# EAGLE design Grove - IMU 10DOF v1.1 (EAGLE 6.4)

## Sheet 1 of 2
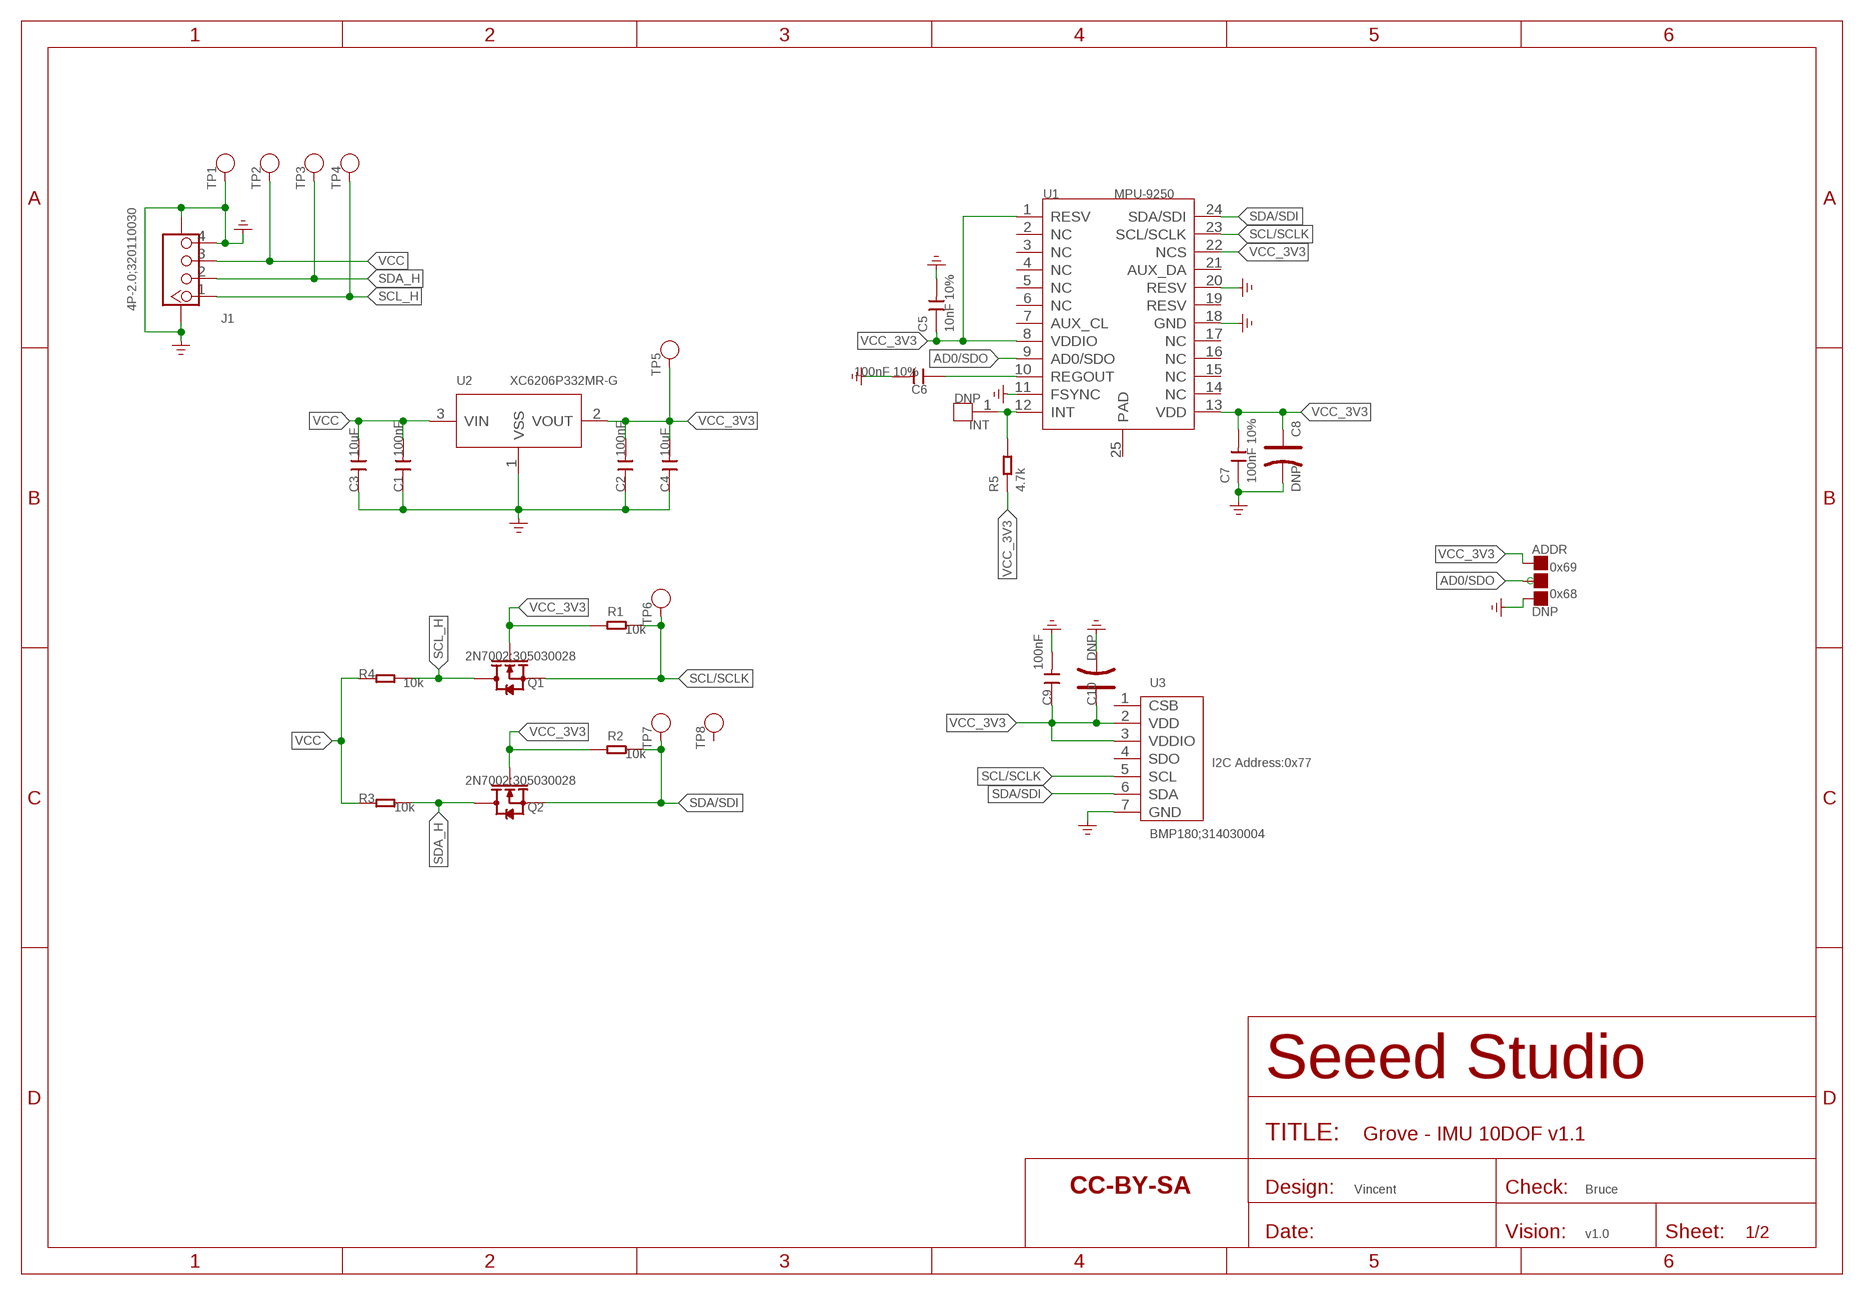
[diagram p0: schematic, sheet 1]

### Parts
ADDR  DNP  PAD-JUMPER-3P-40*40  [3P-SMD-L4.1*W1.5MM]
C1  100nF  CAP-0603  [C0603]
C2  100nF  CAP-0603  [C0603]
C3  10uF  CAP-0805  [C0805]
C4  10uF  CAP-0805  [C0805]
C5  10nF 10%  CAP-0603  [C0603]
C6  100nF 10%  CAP-0603  [C0603]
C7  100nF 10%  CAP-0603  [C0603]
C8  DNP  CAP-POLAR-AVX-A  [AVX-A]
C9  100nF  CAP-0603  [C0603]
C10  DNP  CAP-POLAR-AVX-A  [AVX-A]
INT  DNP  HEADER-1P-35  [1P-65/35MIL]
J1  4P-2.0;320110030  GROVE-CONNECTOR-SMD'DD'  [4P-SMD-2.0]
Q1  2N7002;305030028  MOSFET-N'SOT23'  [SOT-23]
Q2  2N7002;305030028  MOSFET-N'SOT23'  [SOT-23]
R1  10k  RES-0603  [R0603]
R2  10k  RES-0603  [R0603]
R3  10k  RES-0603  [R0603]
R4  10k  RES-0603  [R0603]
R5  4.7k  RES-0603  [R0603]
TP1  DNP  PAD-TEST-POINT'4545'  [TP-D45MIL]
TP2  DNP  PAD-TEST-POINT'4545'  [TP-D45MIL]
TP3  DNP  PAD-TEST-POINT'4545'  [TP-D45MIL]
TP4  DNP  PAD-TEST-POINT'4545'  [TP-D45MIL]
TP5  DNP  PAD-TEST-POINT'4545'  [TP-D45MIL]
TP6  DNP  PAD-TEST-POINT'4545'  [TP-D45MIL]
TP7  DNP  PAD-TEST-POINT'4545'  [TP-D45MIL]
TP8  DNP  PAD-TEST-POINT'4545'  [TP-D45MIL]
U1  MPU-9250  [LEAD-QFN24]
U2  XC6206P332MR-G  PMIC-XC6206PMR  [SOT-23]
U3  BMP180;314030004  BMP180  [LGA-7]
U$1  SEEEDSTUDIO-OPEN-SCH-FRAME  [SEEEDSTUDIO-PCB-FRAME]

### Nets
AD0/SDO: ADDR.MM(C) U1.9(AD0/SDO)
GND: ADDR.11(R) C1.1 C2.1 C3.1 C4.1 C5.2 C6.2 C7.1 C8.- C9.2 C10.- J1.4 J1.SS1 J1.SS2 TP1.T U1.11(FSYNC) U1.18(GND) U1.20(RESV) U2.1(VSS) U3.7(GND) ; supply symbol labelled GND_POWER
N$3: C6.1 U1.10(REGOUT)
N$4: INT.1 R5.2 U1.12(INT)
SCL/SCLK: Q1.2(S) R1.2 TP6.T U1.23(SCL/SCLK) U3.5(SCL)
SCL_H: J1.1 Q1.3(D) R4.2 TP4.T
SDA/SDI: Q2.2(S) R2.2 TP7.T U1.24(SDA/SDI) U3.6(SDA)
SDA_H: J1.2 Q2.3(D) R3.2 TP3.T
VCC: C1.2 C3.2 J1.3 R3.1 R4.1 TP2.T U2.3(VIN)
VCC_3V3: ADDR.00(L) C2.2 C4.2 C5.1 C7.2 C8.+ C9.1 C10.+ Q1.1(G) Q2.1(G) R1.1 R2.1 R5.1 TP5.T U1.1(RESV) U1.8(VDDIO) U1.13(VDD) U1.22(NCS) U2.2(VOUT) U3.2(VDD) U3.3(VDDIO)
Unconnected: TP8.T U1.2(NC) U1.3(NC) U1.4(NC) U1.5(NC) U1.6(NC) U1.7(AUX_CL) U1.14(NC) U1.15(NC) U1.16(NC) U1.17(NC) U1.19(RESV) U1.21(AUX_DA) U1.25(PAD) U3.1(CSB) U3.4(SDO)

### Notes on the sheet
- 0x69
- 0x68
- I2C Address:0x77
- Vincent | Bruce
- v1.0

## Sheet 2 of 2

## Library data of the parts
ADDR = Discrete-new:PAD-JUMPER-3P; PARTNO: DNP
C1-C7 C9 = Discrete-new:CAP: Ceramic Capacitors
C8 C10 = Discrete-new:CAP-POLAR: Electrolytic Capacitors,Tantalum Capacitors and Super Capacitors
INT = Connector-new:HEADER-1P
J1 = Connector-new:GROVE-CONNECTOR-SMD: 4P-SMD-2.0:320110030;4P-SMD-2.0-90D:320110032
Q1 Q2 = Discrete-new:MOSFET-N: IRLL014: http://www.vishay.com/docs/91319/sihll014.pdf
R1-R5 = Discrete-new:RES
TP1-TP8 = Discrete-new:PAD-TEST-POINT; PARTNO: DNP
U1 = template:MPU-9250
U2 = IC-new:PMIC-XC6206P: LOW ESR Cap.Compatible Positive Voltage Regulators
U3 = template:BMP180: Digital pressure sensor
U$1 = moudle-new:SEEEDSTUDIO-OPEN-SCH-FRAME

## Board
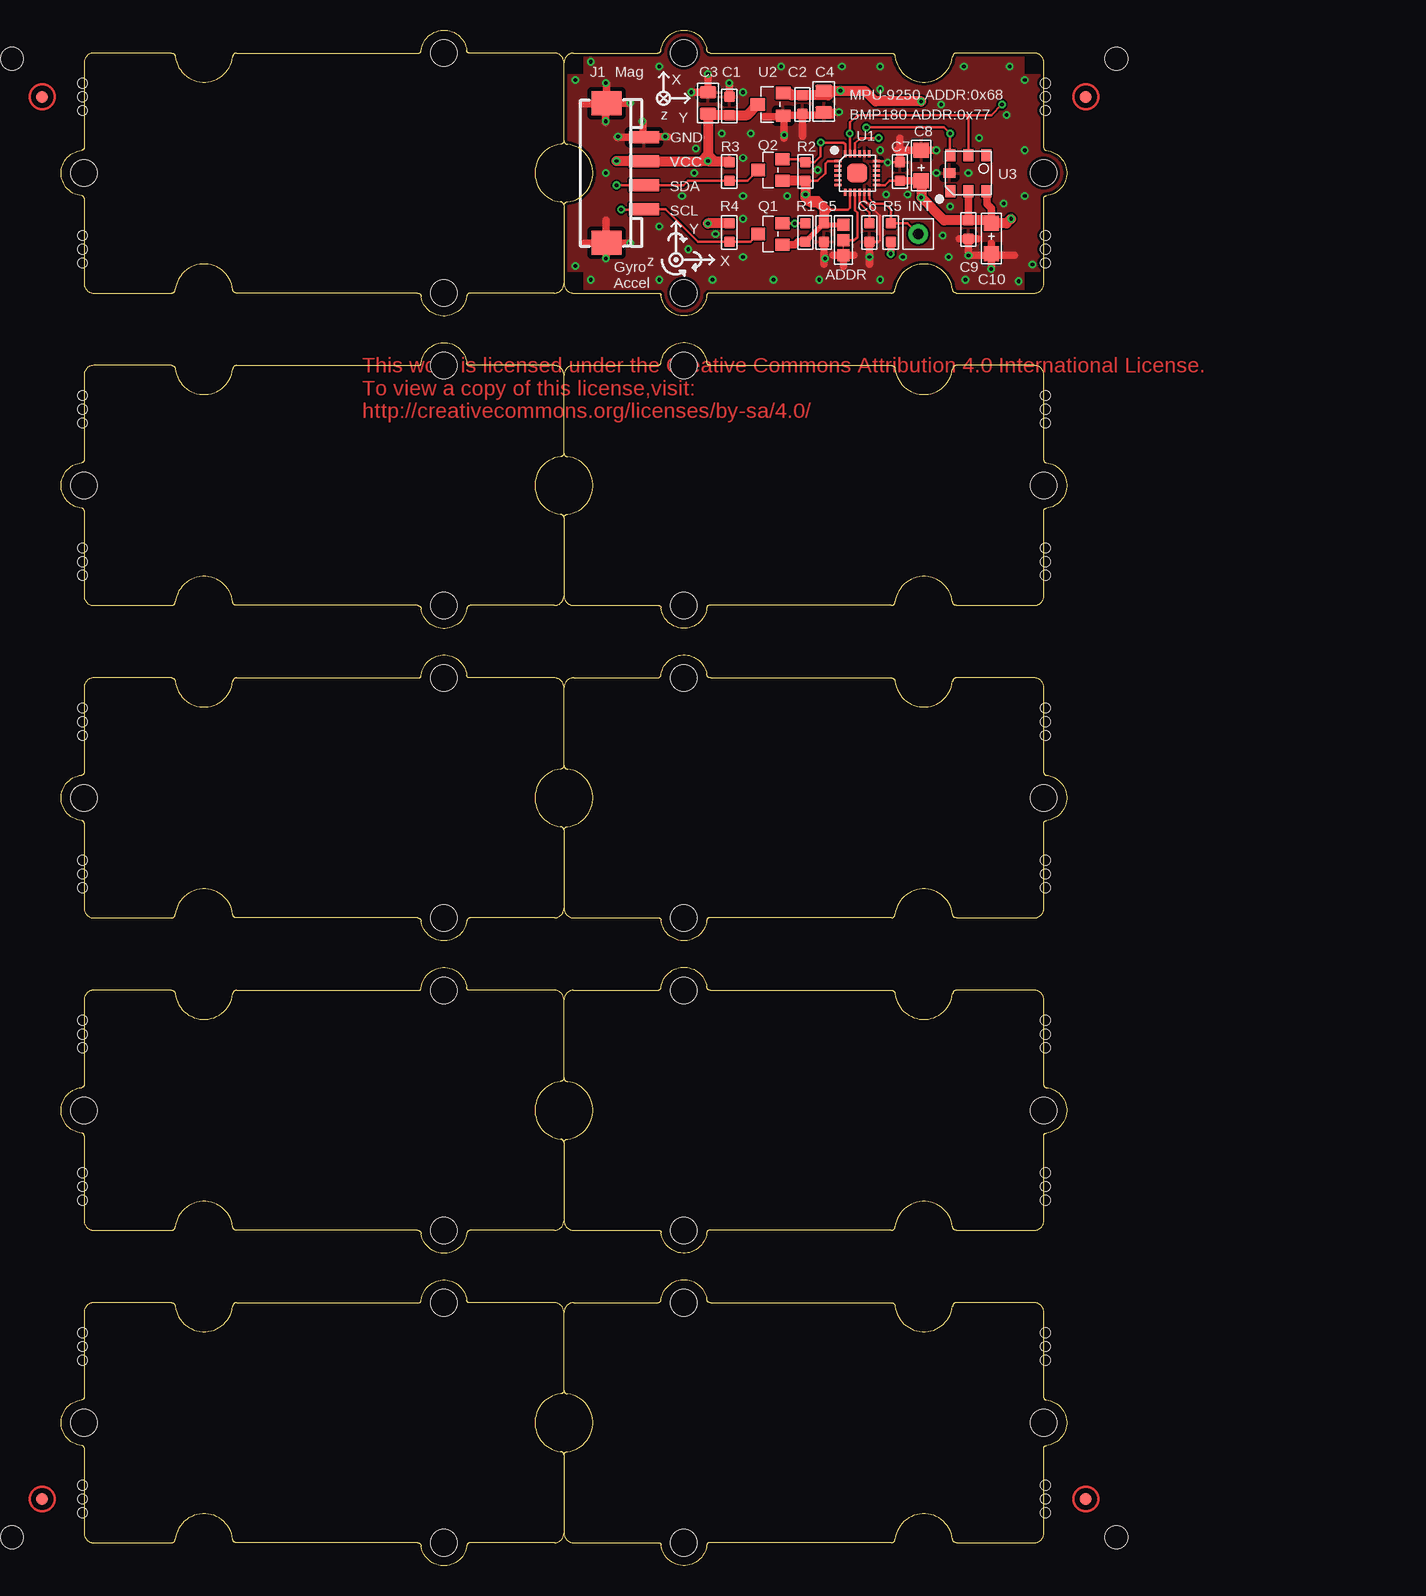
[diagram p1: board, top side]
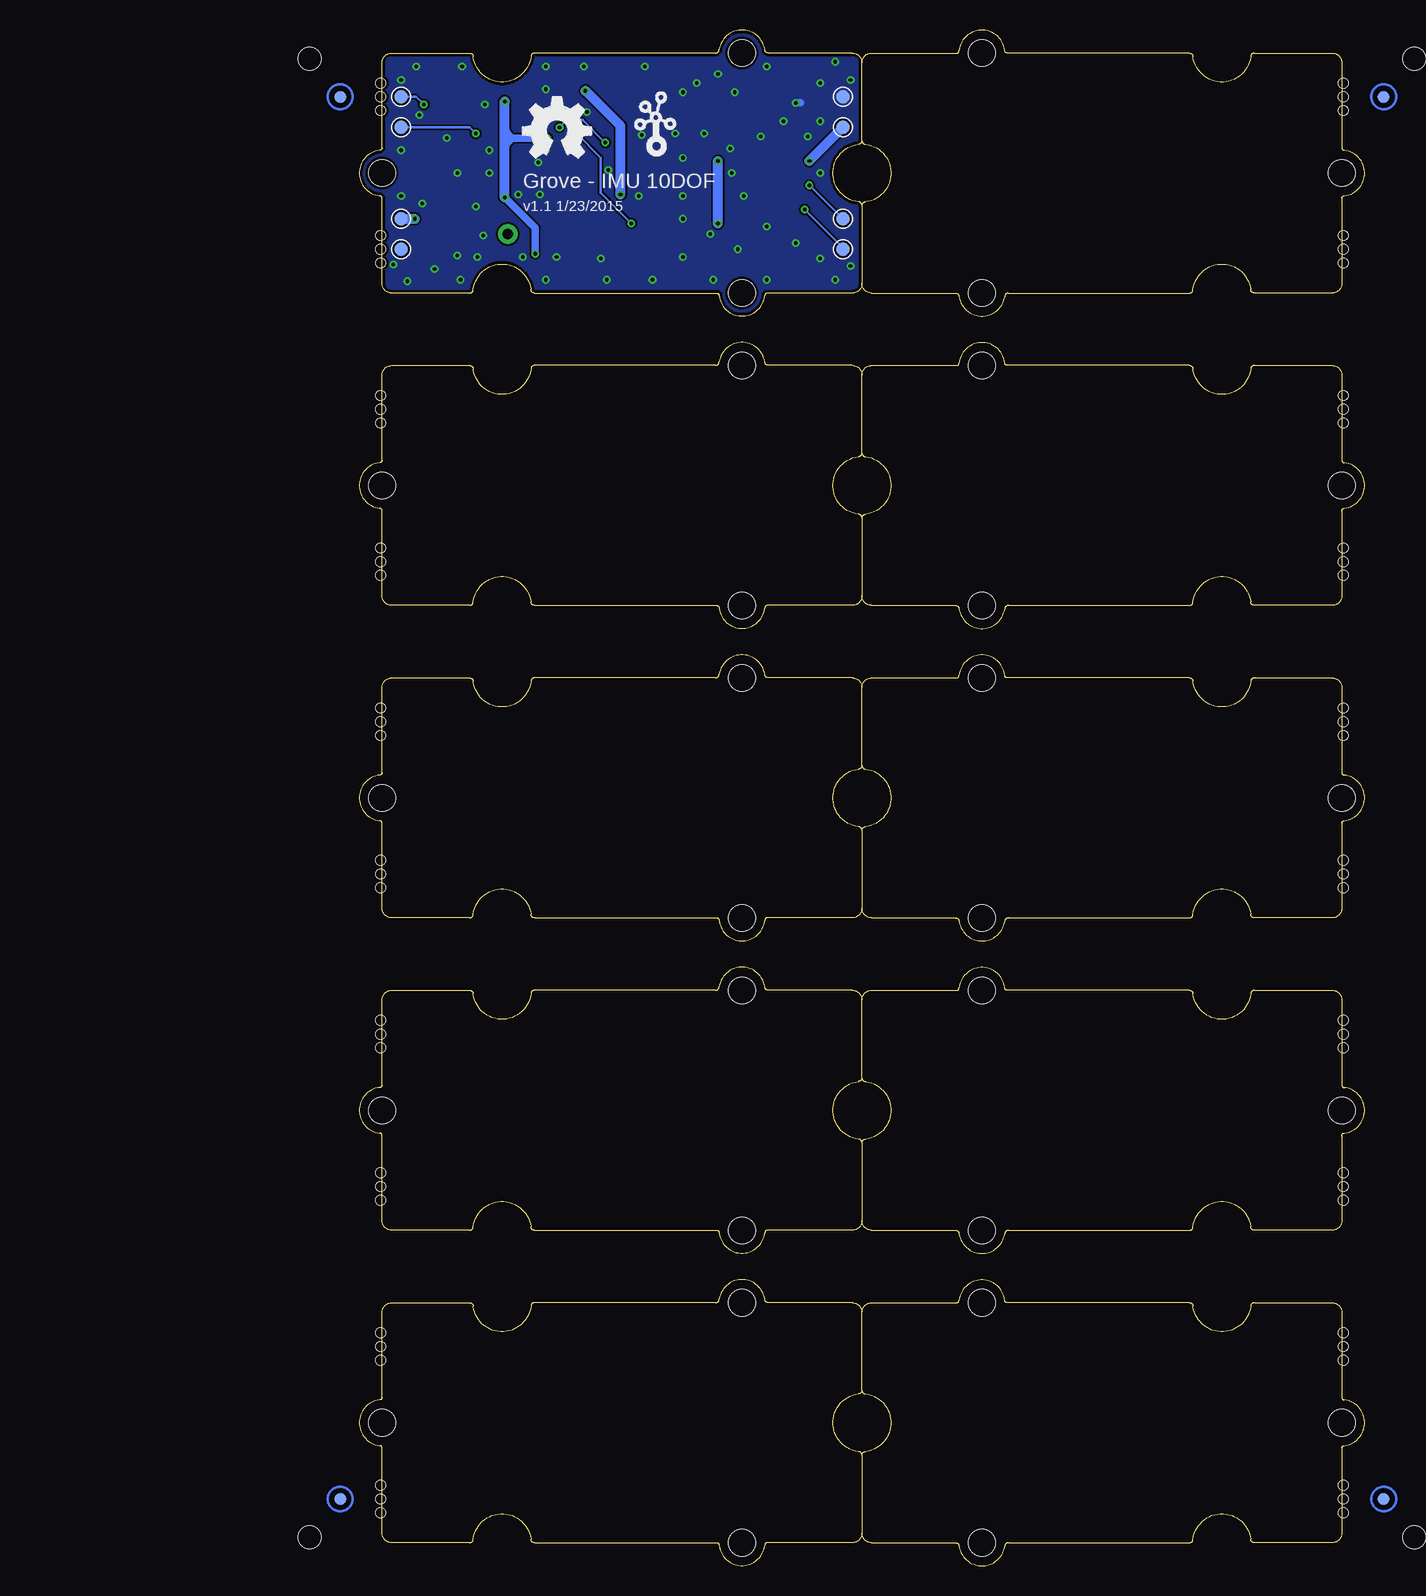
[diagram p2: board, bottom side, seen from below]

Size 83.82 x 127.98 mm. Coordinates in mm from the lower left corner, seen from the top.
Copper layers (1*16): Top 0.035mm / dielectric 1.5mm / Bottom 0.035mm
Design rules "SeeedStudio_2layer_DRU_no_angle_20140221 *": minimum track width 4mil, minimum drill 12mil, track to track 6mil, track to pad 6mil, pad to pad 5mil, via to via 6mil, smd to smd 0mil, copper to edge 10mil, drill to drill 10mil, minimum pad ring 10mil, minimum via ring 6mil, stop-mask expansion 2mil, vias tented up to drill 25mil, thermal gap 14mil
Holes 0.8 mm at 1.78,123.55 1.78,121.27 1.78,122.41 1.78,110.85 1.78,108.57 1.78,109.71 1.78,97.52 1.78,95.23 1.78,96.38 1.78,84.82 1.78,82.53 1.78,83.68 1.78,71.48 1.78,69.2 1.78,70.34 1.78,58.78 1.78,56.5 1.78,57.64 1.78,45.45 1.78,43.16 1.78,44.31 1.78,32.75 1.78,30.46 1.78,31.61 1.78,19.41 1.78,17.13 1.78,18.27 1.78,6.71 1.78,4.43 1.78,5.57 82.04,121.27 82.04,123.55 82.04,122.41 82.04,108.57 82.04,110.85 82.04,109.71 82.04,95.23 82.04,97.52 82.04,96.38 82.04,82.53 82.04,84.82 82.04,83.68 82.04,69.2 82.04,71.48 82.04,70.34 82.04,56.5 82.04,58.78 82.04,57.64 82.04,43.16 82.04,45.45 82.04,44.31 82.04,30.46 82.04,32.75 82.04,31.61 82.04,17.13 82.04,19.41 82.04,18.27 82.04,4.43 82.04,6.71 82.04,5.57
Holes 1.91 mm at -4.13,2.4 87.95,2.4 87.95,125.59 -4.13,125.59

### Footprints (pad centres in the part's own frame; a part is rotated, then mirrored left to right if it is on the bottom)
3P-SMD-L4.1*W1.5MM = smd 1.016 x 1.016: 00 -1.27,0; 11 1.27,0; MM 0,0
C0603 = smd 0.889 x 0.889: 1 0,0.762; 2 0,-0.762
C0805 = smd 1.397 x 1.016: 1 0,0.889; 2 0,-0.889
AVX-A = smd 1.27 x 1.27: + -1.27,0; - 1.27,0
1P-65/35MIL = drill 0.889 pad 1.651: 1 0,0
4P-SMD-2.0 = smd 1 x 2.5: 1 -3,0; 2 -1,0; 3 1,0; 4 3,0 | smd 2 x 2.5: SS1 -5.8,3.123; SS2 5.8,3.123
ROUND-MARK-1.0 = smd 1.016 x 1.016: P$1 0,0
SOT-23 = smd 1.016 x 1.143: 1 -0.889,-1.016; 2 0.889,-1.016; 3 0,1.016
R0603 = smd 0.889 x 0.889: 1 0,0.762; 2 0,-0.762
TP-D45MIL = smd 1.143 x 1.143: T 0,0
LEAD-QFN24 = smd 0.6 x 0.2: 1 -1.6,1; 2 -1.6,0.6; 3 -1.6,0.2; 4 -1.6,-0.2; 5 -1.6,-0.6; 6 -1.6,-1; 13 1.6,-1; 14 1.6,-0.6; 15 1.6,-0.2; 16 1.6,0.2; 17 1.6,0.6; 18 1.6,1 | smd 0.2 x 0.6: 7 -1,-1.6; 8 -0.6,-1.6; 9 -0.2,-1.6; 10 0.2,-1.6; 11 0.6,-1.6; 12 1,-1.6; 19 1,1.6; 20 0.6,1.6; 21 0.2,1.6; 22 -0.2,1.6; 23 -0.6,1.6; 24 -1,1.6 | smd 1.7 x 1.54: 25 0,0
SOT-23' = smd 1.016 x 1.2: 1 -0.95,-1.06; 2 0.95,-1.06; 3 0,1.06
LGA-7 = smd 0.8 x 1: 1 1.5,1.5; 2 0,1.5; 3 -1.5,1.5; 4 -1.5,-1.5; 5 0,-1.5; 6 1.5,-1.5 | smd 1 x 0.8: 7 1.6,0
GROVE-TEST-PLATFORM = hole 2.2: -10,-10; -10,10; 20,0
GROVE-1*2-TEST-PLATFORM = hole 2.2: -10,-10; -10,10; 20,0

### Placement (x,y rotation side)
ADDR  65.22,110.47 270 top
C1  55.69,121.65 0 top
C2  61.79,121.78 180 top
C3  53.91,121.9 0 top
C4  63.56,122.03 180 top
C5  63.56,111.11 0 top
C6  67.37,111.11 0 top
C7  69.91,116.19 0 top
C8  71.69,116.7 90 top
C9  75.63,111.36 0 top
C10  77.53,110.6 270 top
INT  71.44,110.98 0 top
J1  48.58,116.06 90 top
P1  [ROUND-MARK-1.0]  -1.59,5.57 0 top
P2  [ROUND-MARK-1.0]  85.41,5.57 0 top
P3  [ROUND-MARK-1.0]  -1.59,122.41 0 top
P4  [ROUND-MARK-1.0]  85.41,122.41 0 top
P5  [ROUND-MARK-1.0]  -1.59,5.57 0 bottom
P6  [ROUND-MARK-1.0]  85.41,5.57 0 bottom
P7  [ROUND-MARK-1.0]  85.41,122.41 0 bottom
P8  [ROUND-MARK-1.0]  -1.59,122.41 0 bottom
Q1  59.12,110.98 90 top
Q2  59.12,116.32 90 top
R1  62.04,111.11 180 top
R2  62.04,116.19 180 top
R3  55.69,116.19 0 top
R4  55.69,111.11 0 top
R5  69.15,111.11 180 top
TP1  43.5,122.41 0 bottom
TP2  43.5,119.87 0 bottom
TP3  43.5,112.25 0 bottom
TP4  43.5,109.71 0 bottom
TP5  80.33,112.25 0 bottom
TP6  80.33,122.41 0 bottom
TP7  80.33,119.87 0 bottom
TP8  80.33,109.71 0 bottom
U1  66.36,116.06 0 top
U2  XC6206P332MR-G  [SOT-23']  59.12,121.78 90 top
U3  75.63,116.06 180 top
U4  [GROVE-TEST-PLATFORM]  61.91,37.96 0 top
U5  [GROVE-TEST-PLATFORM]  21.91,37.96 180 top
U6  [GROVE-TEST-PLATFORM]  61.91,63.99 0 top
U7  [GROVE-TEST-PLATFORM]  21.91,63.99 180 top
U8  [GROVE-TEST-PLATFORM]  61.91,90.03 0 top
U9  [GROVE-TEST-PLATFORM]  21.91,90.03 180 top
U10  [GROVE-TEST-PLATFORM]  21.91,116.06 180 top
U11  [GROVE-TEST-PLATFORM]  61.91,116.06 0 top
U12  [GROVE-TEST-PLATFORM]  61.91,11.92 0 top
U13  [GROVE-TEST-PLATFORM]  21.91,11.92 180 top
U$1  25.08,95.61 0 top
U$15  [GROVE-1*2-TEST-PLATFORM]  61.91,116.06 0 top
U$16  [GROVE-SILK-SMALL]  61.28,117.33 0 bottom
U$17  [OSHW_FILLX200_NOTEXT]  70.17,117.33 0 bottom

### Tracks (layer width: path | path; a pad name or v marks a point on that pad's centre or on a via)
AD0/SDO
  Top 0.102: 65.22,109.46 65.22,110.35
  Top 0.203: U1.9 66.16,112.96 66.36,112.76 66.36,110.73 66.1,110.47 ADDR.MM 65.22,110.35
GND  (via drill 0.3 pad 0.64)
  Top 0.203: U1.18 68.88,117.06 68.99,116.95 C7.1 | U1.11 66.96,113.81 68.26,112.51 68.26,110.47 68.14,110.35 C6.2 | 48.63,119.07 46.46,119.07 v46.42,119.11
  Top 0.61: J1.SS2 47.39,121.86 v47.44,121.9 | ADDR.11 65.22,108.31 | ADDR.11 66.1,109.2 | 64.33,109.2 ADDR.11 | 45.45,121.57 45.45,123.51 | 45.35,121.82 43.41,121.82 | 45.36,121.85 45.36,120.29 | 48.63,119.07 50.57,119.07 | 48.49,119.03 48.49,120.34 | 48.27,119.02 46.33,119.02 | C5.2 63.56,108.44 | C6.2 67.37,108.44 | C9.2 v75.63,109.2 77.41,109.2 | 77.53,109.2 v77.53,108.06 | 77.53,109.2 79.44,109.2 | 69.91,117.08 69.91,118.98 | v72.96,117.97 69.66,117.97 | v53.91,124.32 C3.1 v52.52,122.79 | C1.1 v55.69,123.55 | v45.4,108.95 45.4,110.09 | v47.44,110.22 45.4,110.22 | 45.4,110.22 43.63,110.22 | 45.4,112.12 45.4,110.22 | 63.44,121.14 v64.83,121.14 | 58.61,120.76 60.52,120.76 | 60.26,118.98 60.26,120.89 | 61.79,119.11 C2.1 | 64.2,120.89 60.39,120.89 | 74.87,110.6 C9.2 | C9.2 76.39,110.6 | 77.53,109.2 77.53,110.22
  Bottom 0.61: v47.44,121.9 47.05,121.9
  other vias: 49.85,124.95 44.13,125.33 60.01,124.95 65.09,124.95 68.26,124.95 75.25,124.95 79.06,124.95 78.8,120.89 49.85,107.17 44.13,107.17 42.86,108.31 49.85,111.62 54.29,107.17 59.37,107.17 63.18,107.17 68.26,107.17 56.83,117.33 56.83,112.25 51.75,114.16 57.47,119.36 80.33,117.97 80.33,114.16 75.63,116.06 72.96,116.06 60.26,119.24 68.26,123.05 73.34,121.78 68.77,114.28 74.11,113.27 73.47,110.85 75.38,107.17 79.82,107.04 67.37,109.08 63.69,108.95 48.45,120.38 45.4,123.55 45.4,120.38 56.83,122.79 55.06,119.36 56.83,114.16 56.83,109.08 80.96,108.44 80.33,123.81 42.86,123.81 68.9,116.95 68.26,117.97 76.52,118.98 78.55,113.52 60.52,114.16 50.36,119.11 63.06,116.32 70.55,114.28 70.17,109.08 73.98,109.08 54.55,110.98 52.26,109.71 45.4,116.06 52.77,116.06 52.9,118.09
  pour Top: 38.42,129.27 86.68,129.27 86.68,100.19 38.42,100.19
  pour Bottom (rank 2): 38.42,129.27 86.68,129.27 86.68,100.19 38.42,100.19
  pour Bottom (rank 2): 38.67,129.27 86.93,129.27 86.93,100.19 38.67,100.19
N$3
  Top 0.203: U1.10 66.56,113.58 67.37,112.76 C6.1
N$4
  Top 0.203: U1.12 67.36,113.92 67.76,113.52 68.64,113.52 69.15,113.01 R5.2 70.55,111.87 INT.1
SCL/SCLK  (via drill 0.3 pad 0.64)
  Top 0.203: Q1.2 v61.15,111.87 R1.2 | U1.23 65.76,119.4 | 75.88,120.89 77.53,120.89 v78.42,121.78 | 75.88,120.89 75.63,120.89 | 75.63,120.89 75.38,120.89 | 75.38,120.89 66.36,120.89 65.76,120.29 65.76,119.4 | 75.5,117.69 U3.5 75.63,120.63 | 75.63,120.89 75.63,120.63 | 75.63,120.63 75.88,120.89 | 75.38,120.89 75.63,120.63 | 65.76,119.4 v65.72,119.36
  Bottom 0.203: v61.15,111.87 63.69,114.41 63.69,117.33 v65.72,119.36 | v78.42,121.78 79.06,122.41 TP6.T
SCL_H  (via drill 0.3 pad 0.64)
  Top 0.203: Q1.3 57.47,110.35 R4.2 53.07,110.35 50.36,113.06 J1.1 48.53,113.01 v46.67,113.01
  Bottom 0.203: v46.67,113.01 43.5,109.84 TP4.T
SDA/SDI  (via drill 0.3 pad 0.64)
  Top 0.203: Q2.2 61.41,117.2 | 61.41,117.2 61.91,117.2 | U1.24 65.36,118.46 65.22,118.6 v63.31,118.6 63.31,117.46 62.8,116.95 R2.2 61.66,116.95 61.41,117.2 | U3.6 74.11,117.59 v74.11,119.36 73.6,119.87 v67.12,119.87
  Bottom 0.203: TP7.T 74.61,119.87 v74.11,119.36 | v63.31,118.6 65.22,120.51 66.49,120.51 v67.12,119.87
SDA_H  (via drill 0.3 pad 0.64)
  Top 0.203: 48.56,115.05 J1.2 48.59,115.05 48.71,115.05 51.88,115.05 52.26,115.43 R3.2 57.21,115.43 Q2.3 | v46.29,115.05 47.82,115.05
  Top 0.61: 48.71,115.05 47.82,115.05
  Bottom 0.203: v46.29,115.05 TP3.T
VCC  (via drill 0.3 pad 0.64)
  Top 0.203: 53.93,117.59 53.91,117.57 | R3.1 55.69,117.05 55.67,117.06
  Top 0.813: 53.4,117.06 J1.3 48.56,117.08 v46.29,117.08 | 55.67,117.06 v53.91,117.06 53.4,117.06 | 53.4,117.06 53.91,117.57 C3.2 54.04,120.89 C1.2 57.17,120.89 U2.3 | 53.93,117.59 54.44,117.08 | R4.1 v53.91,111.87
  Bottom 0.813: v46.29,117.08 TP2.T | v53.91,111.87 v53.91,117.06
VCC_3V3  (via drill 0.3 pad 0.64)
  Top 0.203: U1.8 65.76,113.18 65.6,113.01 64.2,113.01 | C5.1 63.56,112.38 63.56,112.76 63.82,113.01 64.2,113.01 | R2.1 63.06,115.43 63.69,116.06 63.69,116.82 63.93,117.06 U1.1 | 64.2,113.01 63.18,114.03 62.29,114.03 | 64.2,113.01 63.82,112.63 | U1.13 68.66,115.06 69.03,115.43 C7.2 | U1.22 66.16,118.53 66.61,118.98 v68.14,118.98
  Top 0.406: ADDR.00 63.69,111.74 C5.1 R1.1
  Top 0.61: C8.+ C7.2 | U3.2 C9.1 | U3.3 77.15,114.54 77.15,113.52 77.53,113.14 C10.+ | R1.1 61.41,110.35 61.15,110.09 Q1.1 | R5.1 v69.15,109.33
  Top 0.813: C4.2 64.33,122.92 | 64.33,122.92 v64.96,122.92 66.99,122.92 67.88,122.03 v71.69,122.03 | C8.+ v71.69,114.03 73.6,112.12 C9.1 77.28,112.12 C10.+ 78.8,111.87 v79.19,112.25 | Q2.1 R2.1 v62.04,114.28 62.04,114.03 62.42,113.65 63.06,113.65 63.56,113.14 63.56,112.38 | 64.33,122.92 63.95,122.54 C2.2 60.9,122.54 60.71,122.73 U2.2
  Bottom 0.61: v68.14,118.98 71.06,118.98 | 71.06,118.98 71.69,118.98 | 71.69,118.35 71.06,118.98 | 71.06,118.98 71.69,119.62 | v69.15,109.33 69.15,111.49 v71.69,114.03
  Bottom 0.813: v71.69,114.03 71.69,118.35 71.69,118.98 71.69,119.62 v71.69,122.03 | TP5.T v79.19,112.25 | v62.04,114.28 62.04,120 v64.96,122.92

### Text on the board
tPlace: Mag | X | MPU-9250 ADDR:0x68 | Y | z | BMP180 ADDR:0x77 | GND | VCC | SDA | SCL | Y | Gyro / Accel | z | X
bPlace: Grove - IMU 10DOF | v1.1 1/23/2015